# EAGLE design Current (EAGLE 6.4)
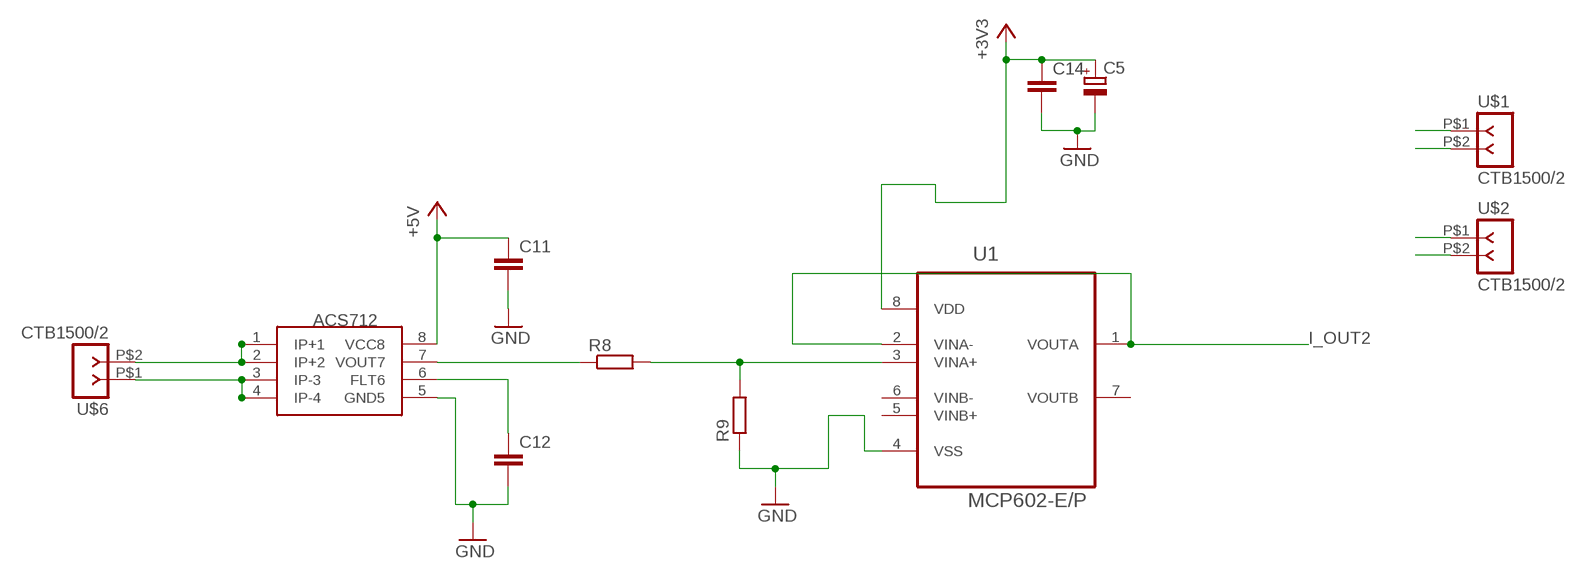
[diagram p0: schematic, sheet 1]

## Parts
C5  CPOL-EUE2-4  [E2-4]
C11  C-EU025-024X044  [C025-024X044]
C12  C-EU025-024X044  [C025-024X044]
C14  C-EU025-024X044  [C025-024X044]
R8  R-EU_0207/7  [0207/7]
R9  R-EU_0207/7  [0207/7]
U1  MCP602-E/P  [DIP254P762X508-8P]
U$1  CTB1500/2  [CTB1500-2]
U$2  CTB1500/2  [CTB1500-2]
U$5  ACS712  [SO8]
U$6  CTB1500/2  [CTB1500-2]

## Nets
+3V3: C5.+ C14.1 U1.8(VDD) U$1.P$2
+5V: C11.1 U$1.P$1 U$5.8(VCC8)
GND: C5.- C11.2 C12.2 C14.2 R9.1 U1.4(VSS) U$2.P$1 U$5.5(GND5)
I_OUT2: U1.2(VINA-) U$2.P$2
N$7: R8.1 U$5.7(VOUT7)
N$14: U$5.3(IP-3) U$5.4(IP-4) U$6.P$1
N$15: C12.1 U$5.6(FLT6)
N$16: U$5.1(IP+1) U$5.2(IP+2) U$6.P$2
N$18: R8.2 R9.2 U1.3(VINA+)
Unconnected: U1.1(VOUTA) U1.5(VINB+) U1.6(VINB-) U1.7(VOUTB)

## Library data of the parts
C5 = resistor:CPOL-EU: POLARIZED CAPACITOR, European symbol
C11 C12 C14 = resistor:C-EU: CAPACITOR, European symbol
R8 R9 = resistor:R-EU_: RESISTOR, European symbol
U1 = MCP:MCP602-E/P: IC, 2.7V to 5.5V Single-Supply CMOS Dual Op Amps,DIP-8; MPN: MCP602-E/P; OC_FARNELL: 1852042; OC_NEWARK: 88H9870; PACKAGE: DIP-8; SUPPLIER: Microchip
U$1 U$2 U$6 = eko-parts:CTB1500/2
U$5 = eko-parts:ACS712

## Board
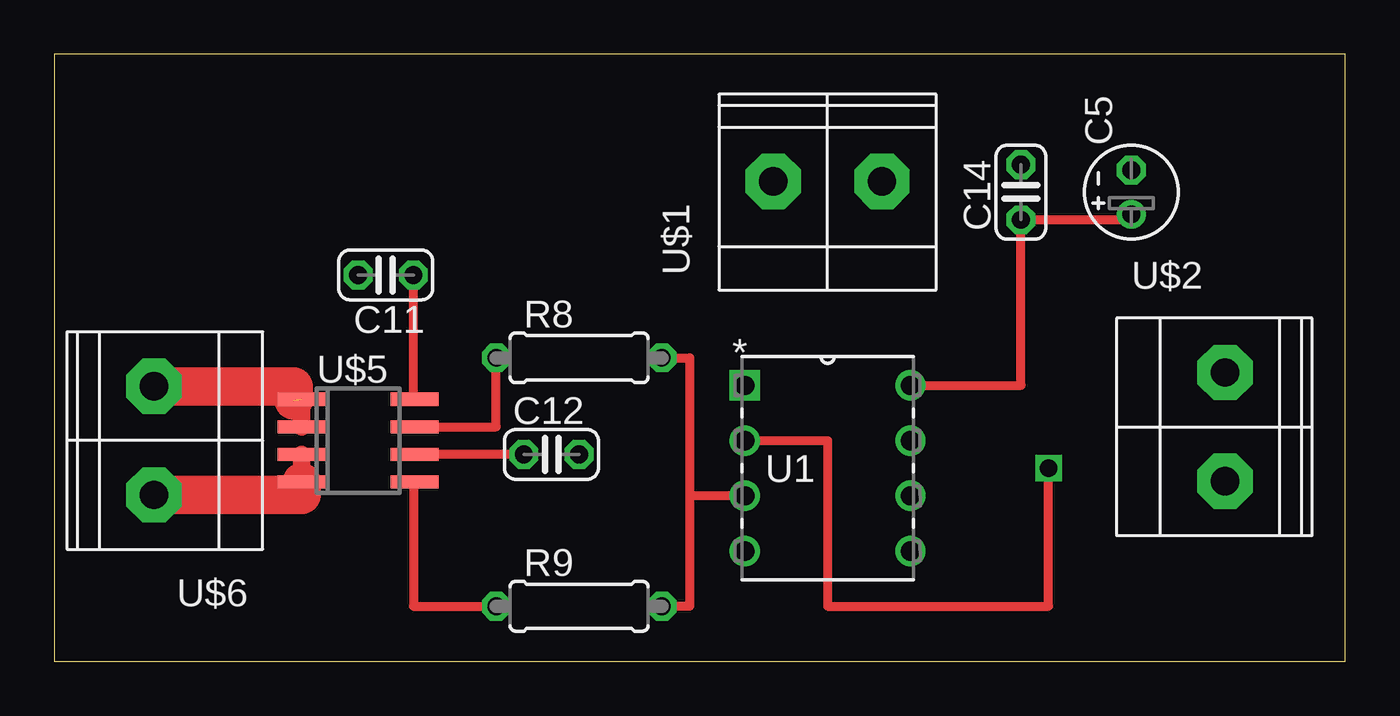
[diagram p1: board, top side]
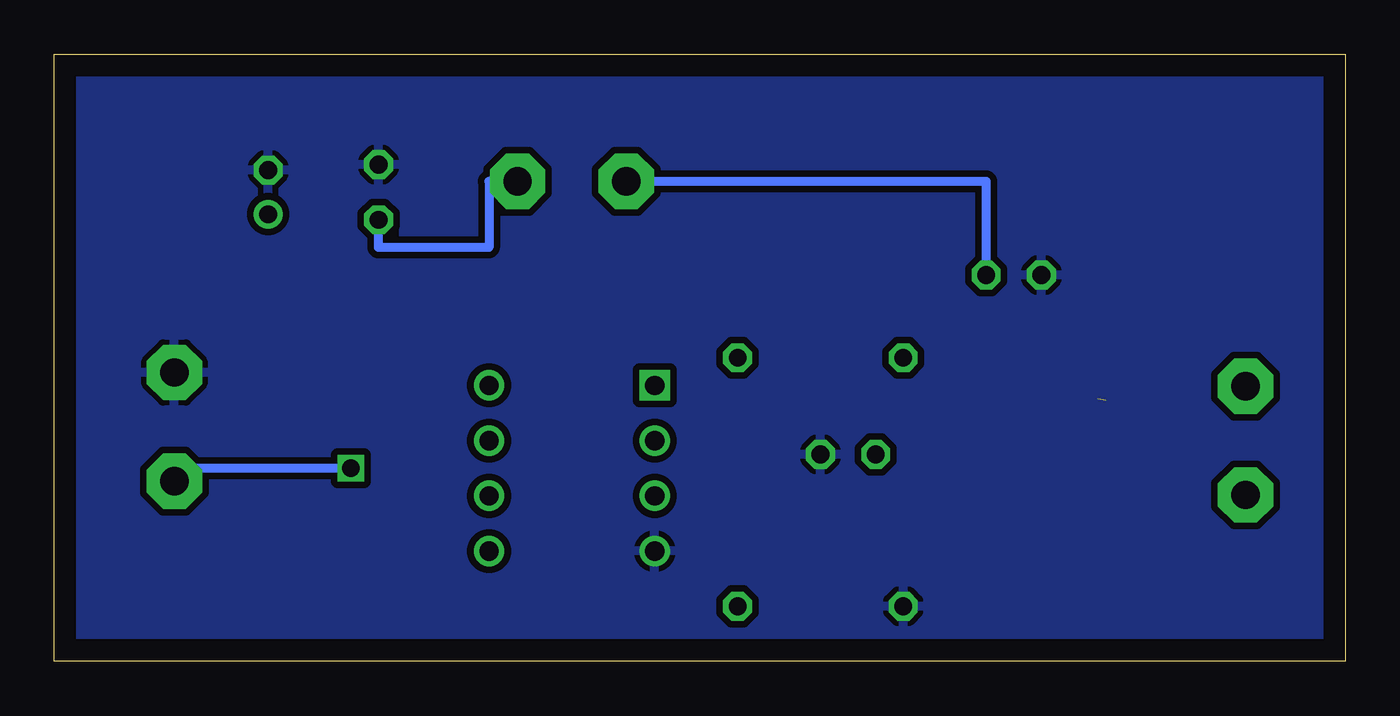
[diagram p2: board, bottom side, seen from below]

Size 59.36 x 27.93 mm. Coordinates in mm from the lower left corner, seen from the top.
Outline: 0,0 59.36,0 59.36,27.93 0,27.93 0,0
Copper layers (1*16): Top 0.035mm / dielectric 1.5mm / Bottom 0.035mm
Design rules "default *": minimum track width 10mil, minimum drill 24mil, track to track 12mil, track to pad 12mil, pad to pad 12mil, via to via 12mil, smd to smd 12mil, copper to edge 40mil, drill to drill 8mil, minimum pad ring 10mil, minimum via ring 8mil, stop-mask expansion 4mil, vias tented up to drill 0mil, thermal gap 10mil

### Footprints (pad centres in the part's own frame; a part is rotated, then mirrored left to right if it is on the bottom)
E2-4 = drill 0.813 pad 1.27: + -1.016,0 | drill 0.813 pad 1.27 octagon: - 1.016,0
C025-024X044 = drill 0.813 octagon: 1 -1.27,0; 2 1.27,0
0207/7 = drill 0.813 octagon: 1 -3.81,0; 2 3.81,0
DIP254P762X508-8P = drill 0.889 square: 1 -7.62,7.62 | drill 0.889: 2 -7.62,5.08; 3 -7.62,2.54; 4 -7.62,0; 5 0,0; 6 0,2.54; 7 0,5.08; 8 0,7.62
CTB1500-2 = drill 1.3 pad 2.54 octagon: P$1 -2.5,0.5; P$2 2.5,0.5
SO8 = smd 0.6 x 2.2: 1 -1.905,-2.6; 2 -0.635,-2.6; 3 0.635,-2.6; 4 1.905,-2.6; 5 1.905,2.6; 6 0.635,2.6; 7 -0.635,2.6; 8 -1.905,2.6

### Placement (x,y rotation side)
C5  49.53,21.59 90 top
C11  15.24,17.78 180 top
C12  22.86,9.53 0 top
C14  44.45,21.59 90 top
R8  24.13,13.97 0 top
R9  24.13,2.54 0 top
U1  39.37,5.08 0 top
U$1  35.56,21.59 0 top
U$2  53.34,10.79 270 top
U$5  13.97,10.16 270 top
U$6  5.08,10.16 90 top

### Tracks (layer width: path | path; a pad name or v marks a point on that pad's centre or on a via)
+3V3
  Top 0.406: U1.8 44.45,12.7 C14.1 49.53,20.32 C5.+
  Bottom 0.406: U$1.P$2 39.37,22.09 39.37,19.05 44.45,19.05 C14.1
+5V
  Top 0.406: U$5.8 16.51,12.06 C11.1
  Bottom 0.406: U$1.P$1 16.51,22.09 C11.1
GND
  Top 0.406: U$5.5 16.51,8.26 16.51,2.54 R9.1
  pour Bottom: 0,27.94 59.69,27.94 59.69,0 0,0
I_OUT2  (via drill 0.8 pad 0.61)
  Top 0.406: U1.2 35.56,10.16 35.56,2.54 45.72,2.54 v45.72,8.89
  Bottom 0.406: v45.72,8.89 53.84,8.89 U$2.P$2
N$7
  Top 0.406: U$5.7 20.32,10.79 R8.1
N$14
  Top 0.813: U$5.3 U$5.4
  Top 1.778: U$6.P$1 11.37,7.66 U$5.4
N$15
  Top 0.406: C12.1 U$5.6
N$16  (1 unrouted)
  Top 0.813: U$5.1 U$5.2
  Top 1.778: U$6.P$2 11,12.66 11,12
N$18
  Top 0.406: R8.2 29.21,13.97 29.21,7.62 | U1.3 29.21,7.62 | 29.21,7.62 29.21,2.54 R9.2